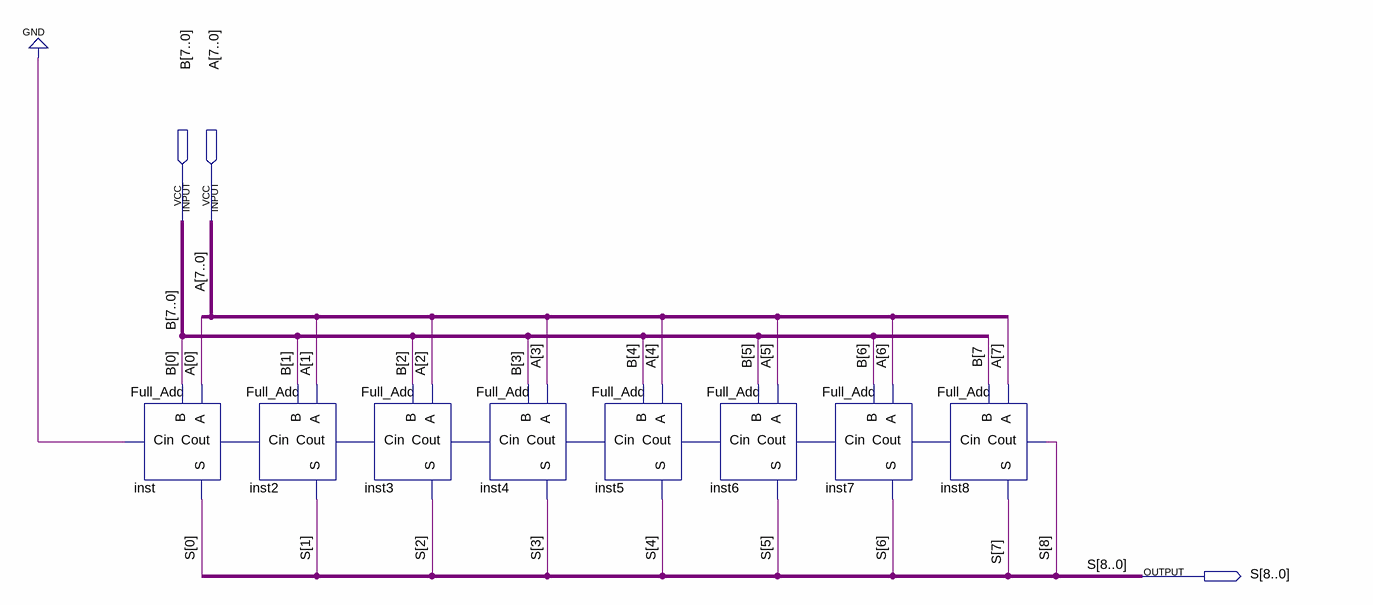
[diagram p0: schematic sheet]
// Quartus schematic Unsigned_8bitadd.bdf as structural Verilog: 8 symbols, 3 pins
module Unsigned_8bitadd (
  input  [7:0] B,
  input  [7:0] A,
  output [8:0] S
);

  wire \B[7 , inst2_cout, inst3_cout, inst4_cout, inst5_cout, inst6_cout, inst7_cout, inst_cout;

  Full_Add inst (.A(A[0]), .B(B[0]), .Cin(1'b0), .S(S[0]), .Cout(inst_cout));
  Full_Add inst2 (.A(A[1]), .B(B[1]), .Cin(inst_cout), .S(S[1]), .Cout(inst2_cout));
  Full_Add inst3 (.A(A[2]), .B(B[2]), .Cin(inst2_cout), .S(S[2]), .Cout(inst3_cout));
  Full_Add inst4 (.A(A[3]), .B(B[3]), .Cin(inst3_cout), .S(S[3]), .Cout(inst4_cout));
  Full_Add inst5 (.A(A[4]), .B(B[4]), .Cin(inst4_cout), .S(S[4]), .Cout(inst5_cout));
  Full_Add inst6 (.A(A[5]), .B(B[5]), .Cin(inst5_cout), .S(S[5]), .Cout(inst6_cout));
  Full_Add inst7 (.A(A[6]), .B(B[6]), .Cin(inst6_cout), .S(S[6]), .Cout(inst7_cout));
  Full_Add inst8 (.A(A[7]), .B(\B[7 ), .Cin(inst7_cout), .S(S[7]), .Cout(S[8]));
endmodule
